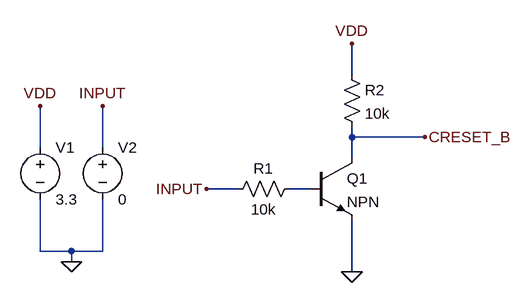
[diagram p0: schematic inverter_test.asc]
inverter_test.asc, the LTspice schematic file:
Version 4
SHEET 1 880 680
WIRE 528 -16 528 -64
WIRE 528 80 528 64
WIRE 640 80 528 80
WIRE 48 96 48 32
WIRE 144 96 144 32
WIRE 528 112 528 80
WIRE 352 160 304 160
WIRE 464 160 432 160
WIRE 48 256 48 176
WIRE 96 256 48 256
WIRE 144 256 144 176
WIRE 144 256 96 256
WIRE 96 272 96 256
WIRE 528 288 528 208
FLAG 96 272 0
FLAG 48 32 VDD
FLAG 144 32 INPUT
FLAG 304 160 INPUT
FLAG 528 288 0
FLAG 528 -64 VDD
FLAG 640 80 CRESET_B
SYMBOL voltage 48 80 R0
SYMATTR InstName V1
SYMATTR Value 3.3
SYMBOL voltage 144 80 R0
SYMATTR InstName V2
SYMATTR Value 0
SYMBOL npn 464 112 R0
SYMATTR InstName Q1
SYMBOL res 448 144 R90
WINDOW 0 0 56 VBottom 2
WINDOW 3 32 56 VTop 2
SYMATTR InstName R1
SYMATTR Value 10k
SYMBOL res 512 -32 R0
SYMATTR InstName R2
SYMATTR Value 10k

The netlist it stands for:
* inverter_test.asc
V1 VDD 0 3.3
V2 INPUT 0 0
Q1 CRESET_B N001 0 0 NPN
R1 N001 INPUT 10k
R2 VDD CRESET_B 10k
.model NPN NPN
.model PNP PNP
.lib standard.bjt
.backanno
.end